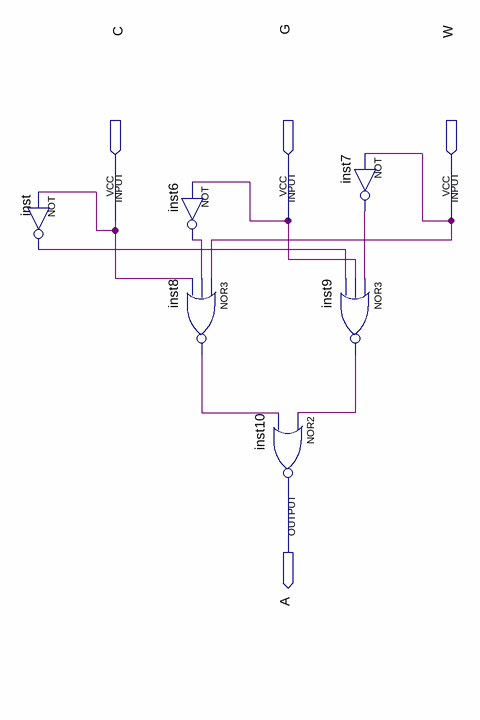
[diagram p0: schematic sheet]
// Quartus schematic lab3step0.bdf as structural Verilog: 6 symbols, 4 pins
module lab3step0 (
  input  C,
  input  G,
  input  W,
  output A
);

  wire inst6_out, inst7_out, inst8_out, inst9_out, inst_out;

  not inst (inst_out, C);
  not inst6 (inst6_out, G);
  nor inst8 (inst8_out, W, inst6_out, C);
  nor inst9 (inst9_out, inst7_out, G, inst_out);
  nor inst10 (A, inst9_out, inst8_out);
  not inst7 (inst7_out, W);
endmodule
